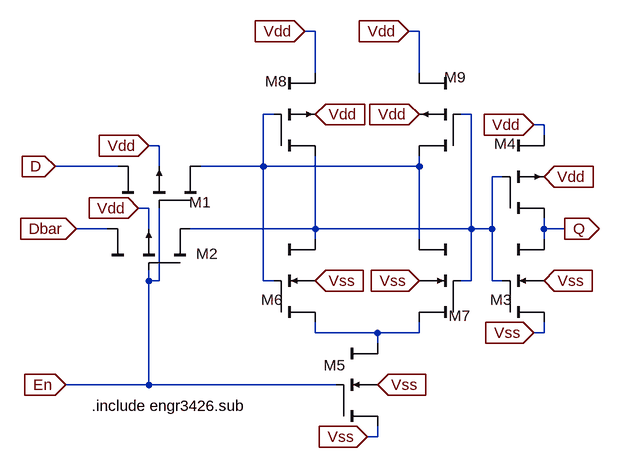
[diagram p0: schematic dflipflopsimple.asc]
dflipflopsimple.asc, the LTspice schematic file:
Version 4
SHEET 1 1276 680
WIRE 112 -288 96 -288
WIRE 272 -288 256 -288
WIRE 112 -224 112 -288
WIRE 272 -224 272 -288
WIRE 48 -160 32 -160
WIRE 352 -160 336 -160
WIRE 464 -144 448 -144
WIRE 464 -128 464 -144
WIRE -128 -112 -144 -112
WIRE -192 -80 -288 -80
WIRE -128 -80 -128 -112
WIRE 32 -80 32 -160
WIRE 32 -80 -64 -80
WIRE 272 -80 272 -96
WIRE 272 -80 32 -80
WIRE 400 -64 384 -64
WIRE -144 -16 -160 -16
WIRE -208 16 -256 16
WIRE -144 16 -144 -16
WIRE 112 16 112 -96
WIRE 112 16 -80 16
WIRE 352 16 352 -160
WIRE 352 16 112 16
WIRE 384 16 384 -64
WIRE 384 16 352 16
WIRE 464 16 464 0
WIRE 496 16 464 16
WIRE 112 32 112 16
WIRE 272 32 272 -80
WIRE 464 32 464 16
WIRE -144 96 -144 80
WIRE -128 96 -128 -16
WIRE -128 96 -144 96
WIRE 32 96 32 -80
WIRE 48 96 32 96
WIRE 352 96 352 16
WIRE 352 96 336 96
WIRE 384 96 384 16
WIRE 400 96 384 96
WIRE 112 176 112 160
WIRE 208 176 112 176
WIRE 272 176 272 160
WIRE 272 176 208 176
WIRE 464 176 464 160
WIRE 464 176 448 176
WIRE 208 192 208 176
WIRE -144 256 -144 96
WIRE -144 256 -272 256
WIRE 144 256 -144 256
WIRE 208 336 208 320
WIRE 208 336 192 336
FLAG 256 -288 Vdd
IOPIN 256 -288 In
FLAG 96 -288 Vdd
IOPIN 96 -288 In
FLAG 192 336 Vss
IOPIN 192 336 In
FLAG 272 96 Vss
IOPIN 272 96 In
FLAG 112 96 Vss
IOPIN 112 96 In
FLAG 272 -160 Vdd
IOPIN 272 -160 In
FLAG 112 -160 Vdd
IOPIN 112 -160 In
FLAG 208 256 Vss
IOPIN 208 256 In
FLAG -144 -112 Vdd
IOPIN -144 -112 In
FLAG -160 -16 Vdd
IOPIN -160 -16 In
FLAG -288 -80 D
IOPIN -288 -80 In
FLAG -256 16 Dbar
IOPIN -256 16 In
FLAG 496 16 Q
IOPIN 496 16 Out
FLAG -272 256 En
IOPIN -272 256 In
FLAG 464 96 Vss
IOPIN 464 96 In
FLAG 464 -64 Vdd
IOPIN 464 -64 In
FLAG 448 -144 Vdd
IOPIN 448 -144 In
FLAG 448 176 Vss
IOPIN 448 176 In
SYMBOL cktsym\\pmos4 -144 16 R270
WINDOW 0 -38 73 VRight 2
WINDOW 3 16 16 Invisible 2
SYMATTR InstName M2
SYMATTR Value2 l=.6u w=1.2u
SYMBOL cktsym\\pmos4 -128 -80 R270
WINDOW 0 -55 46 VRight 2
WINDOW 3 16 16 Invisible 2
SYMATTR InstName M1
SYMATTR Value2 l=.6u w=1.2u
SYMBOL cktsym\\nmos4 208 256 R0
WINDOW 0 -83 -30 Left 2
WINDOW 3 16 16 Invisible 2
SYMATTR InstName M5
SYMATTR Value2 l=.6u w=1.2u
SYMBOL cktsym\\nmos4 112 96 R0
WINDOW 0 -83 29 Left 2
WINDOW 3 16 16 Invisible 2
SYMATTR InstName M6
SYMATTR Value2 l=.6u w=1.2u
SYMBOL cktsym\\nmos4 272 96 M0
WINDOW 0 -79 54 Left 2
WINDOW 3 16 16 Invisible 2
SYMATTR InstName M7
SYMATTR Value2 l=.6u w=1.2u
SYMBOL cktsym\\pmos4 112 -160 R0
WINDOW 0 -77 -51 Left 2
WINDOW 3 16 16 Invisible 2
SYMATTR InstName M8
SYMATTR Value2 l=.6u w=1.2u
SYMBOL cktsym\\pmos4 272 -160 M0
WINDOW 0 -72 -57 Left 2
WINDOW 3 16 16 Invisible 2
SYMATTR InstName M9
SYMATTR Value2 l=.6u w=1.2u
SYMBOL cktsym\\nmos4 464 96 R0
WINDOW 0 -83 29 Left 2
WINDOW 3 16 16 Invisible 2
SYMATTR InstName M3
SYMATTR Value2 l=.6u w=1.2u
SYMBOL cktsym\\pmos4 464 -64 R0
WINDOW 0 -77 -51 Left 2
WINDOW 3 16 16 Invisible 2
SYMATTR InstName M4
SYMATTR Value2 l=.6u w=1.2u
TEXT -232 288 Left 2 !.include engr3426.sub

The netlist it stands for:
* dflipflopsimple.asc
M2 N002 En Dbar Vdd PMOS l=.6u w=1.2u
M1 N001 En D Vdd PMOS l=.6u w=1.2u
M5 N003 En Vss Vss NMOS l=.6u w=1.2u
M6 N002 N001 N003 Vss NMOS l=.6u w=1.2u
M7 N001 N002 N003 Vss NMOS l=.6u w=1.2u
M8 N002 N001 Vdd Vdd PMOS l=.6u w=1.2u
M9 N001 N002 Vdd Vdd PMOS l=.6u w=1.2u
M3 Q N002 Vss Vss NMOS l=.6u w=1.2u
M4 Q N002 Vdd Vdd PMOS l=.6u w=1.2u
.model NMOS NMOS
.model PMOS PMOS
.lib standard.mos
.include engr3426.sub
.backanno
.end